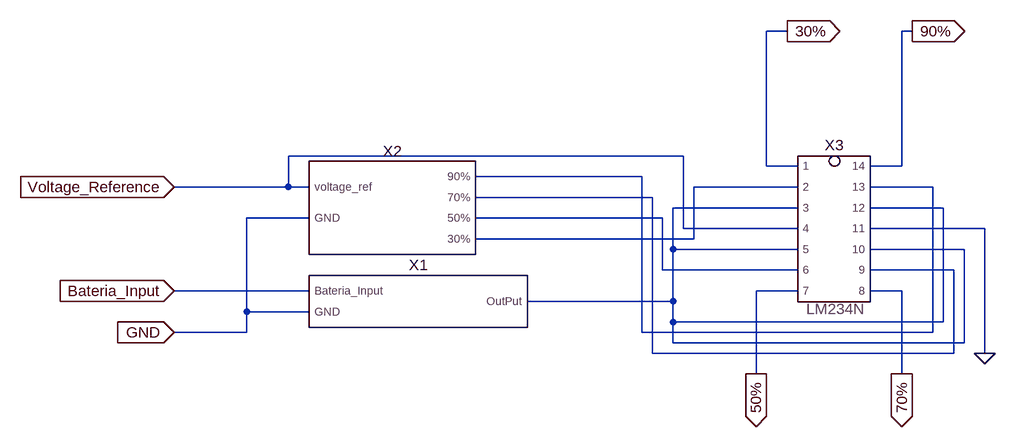
[diagram p0: schematic Modulo_bateria.asc]
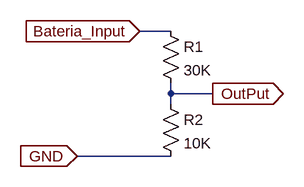
[diagram p1: sub-circuit dividor_bateria.asc]
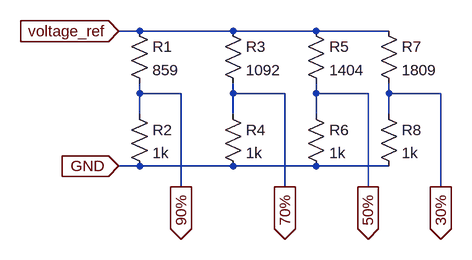
[diagram p2: sub-circuit referencia.asc]
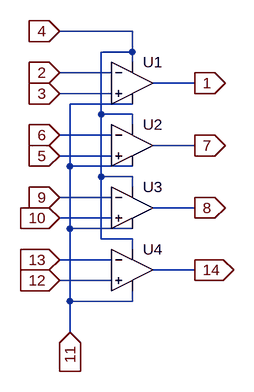
[diagram p3: sub-circuit comparador.asc]
Modulo_bateria.asc, the LTspice schematic file:
Version 4
SHEET 1 1048 680
WIRE 560 -176 528 -176
WIRE 752 -176 736 -176
WIRE 400 16 -208 16
WIRE 528 32 528 -176
WIRE 576 32 528 32
WIRE 736 32 736 -176
WIRE 736 32 688 32
WIRE 336 48 80 48
WIRE -208 64 -208 16
WIRE -208 64 -384 64
WIRE -176 64 -208 64
WIRE 576 64 416 64
WIRE 784 64 688 64
WIRE 352 80 80 80
WIRE 576 96 384 96
WIRE 800 96 688 96
WIRE -176 112 -272 112
WIRE 368 112 80 112
WIRE 400 128 400 16
WIRE 576 128 400 128
WIRE 864 128 688 128
WIRE 416 144 416 64
WIRE 416 144 80 144
WIRE 384 160 384 96
WIRE 576 160 384 160
WIRE 832 160 688 160
WIRE 368 192 368 112
WIRE 576 192 368 192
WIRE 816 192 688 192
WIRE -176 224 -384 224
WIRE 576 224 512 224
WIRE 736 224 688 224
WIRE 384 240 384 160
WIRE 384 240 160 240
WIRE -272 256 -272 112
WIRE -176 256 -272 256
WIRE 384 272 384 240
WIRE 800 272 800 96
WIRE 800 272 384 272
WIRE -272 288 -272 256
WIRE -272 288 -384 288
WIRE 336 288 336 48
WIRE 784 288 784 64
WIRE 784 288 336 288
WIRE 384 304 384 272
WIRE 832 304 832 160
WIRE 832 304 384 304
WIRE 352 320 352 80
WIRE 816 320 816 192
WIRE 816 320 352 320
WIRE 864 320 864 128
WIRE 512 352 512 224
WIRE 736 352 736 224
FLAG 864 320 0
FLAG 560 -176 30%
IOPIN 560 -176 Out
FLAG 512 352 50%
IOPIN 512 352 Out
FLAG 752 -176 90%
IOPIN 752 -176 Out
FLAG 736 352 70%
IOPIN 736 352 Out
FLAG -384 64 Voltage_Reference
IOPIN -384 64 In
FLAG -384 224 Bateria_Input
IOPIN -384 224 In
FLAG -384 288 GND
IOPIN -384 288 In
DATAFLAG 192 48 ""
DATAFLAG 192 80 ""
DATAFLAG 192 112 ""
DATAFLAG 192 144 ""
DATAFLAG 240 240 ""
DATAFLAG -272 64 ""
DATAFLAG -240 224 ""
DATAFLAG -288 288 ""
DATAFLAG 528 -64 ""
DATAFLAG 528 224 ""
DATAFLAG 720 224 ""
DATAFLAG 736 -80 ""
SYMBOL Dividor_Bateria -16 240 R0
SYMATTR InstName X1
SYMBOL Referencia -48 96 R0
SYMATTR InstName X2
SYMBOL Comparador 656 176 R0
SYMATTR InstName X3

dividor_bateria.asc, the sub-circuit schematic file:
Version 4
SHEET 1 880 680
WIRE 80 80 32 80
WIRE 80 176 80 160
WIRE 144 176 80 176
WIRE 80 192 80 176
WIRE 80 272 -64 272
FLAG 32 80 Bateria_Input
IOPIN 32 80 In
FLAG -64 272 GND
IOPIN -64 272 In
FLAG 144 176 OutPut
IOPIN 144 176 Out
SYMBOL res 64 64 R0
SYMATTR InstName R1
SYMATTR Value 30K
SYMBOL res 64 176 R0
SYMATTR InstName R2
SYMATTR Value 10K

referencia.asc, the sub-circuit schematic file:
Version 4
SHEET 1 880 680
WIRE 112 64 80 64
WIRE 256 64 112 64
WIRE 384 64 256 64
WIRE 496 64 384 64
WIRE 112 160 112 144
WIRE 176 160 112 160
WIRE 256 160 256 144
WIRE 336 160 256 160
WIRE 384 160 384 144
WIRE 464 160 384 160
WIRE 496 160 496 144
WIRE 576 160 496 160
WIRE 112 192 112 160
WIRE 256 192 256 160
WIRE 384 192 384 160
WIRE 496 192 496 160
WIRE 112 272 80 272
WIRE 256 272 112 272
WIRE 384 272 256 272
WIRE 496 272 384 272
WIRE 176 304 176 160
WIRE 336 304 336 160
WIRE 464 304 464 160
WIRE 576 304 576 160
FLAG 80 64 voltage_ref
IOPIN 80 64 In
FLAG 80 272 GND
IOPIN 80 272 In
FLAG 576 304 30%
IOPIN 576 304 Out
FLAG 464 304 50%
IOPIN 464 304 Out
FLAG 336 304 70%
IOPIN 336 304 Out
FLAG 176 304 90%
IOPIN 176 304 Out
SYMBOL res 96 48 R0
SYMATTR InstName R1
SYMATTR Value 859
SYMBOL res 96 176 R0
SYMATTR InstName R2
SYMATTR Value 1k
SYMBOL res 240 48 R0
SYMATTR InstName R3
SYMATTR Value 1092
SYMBOL res 240 176 R0
SYMATTR InstName R4
SYMATTR Value 1k
SYMBOL res 368 48 R0
SYMATTR InstName R5
SYMATTR Value 1404
SYMBOL res 368 176 R0
SYMATTR InstName R6
SYMATTR Value 1k
SYMBOL res 480 48 R0
SYMATTR InstName R7
SYMATTR Value 1809
SYMBOL res 480 176 R0
SYMATTR InstName R8
SYMATTR Value 1k

comparador.asc, the sub-circuit schematic file:
Version 4
SHEET 1 880 680
WIRE 96 0 -16 0
WIRE 96 32 96 0
WIRE 96 32 48 32
WIRE 96 48 96 32
WIRE 64 64 -16 64
WIRE 192 80 128 80
WIRE 64 96 -16 96
WIRE 96 112 0 112
WIRE 48 128 48 32
WIRE 96 128 48 128
WIRE 96 144 96 128
WIRE 64 160 -16 160
WIRE 192 176 128 176
WIRE 64 192 -16 192
WIRE 0 208 0 112
WIRE 96 208 0 208
WIRE 48 224 48 128
WIRE 96 224 48 224
WIRE 96 240 96 224
WIRE 64 256 -16 256
WIRE 192 272 128 272
WIRE 64 288 -16 288
WIRE 0 304 0 208
WIRE 96 304 0 304
WIRE 48 320 48 224
WIRE 96 320 48 320
WIRE 96 336 96 320
WIRE 64 352 -16 352
WIRE 192 368 128 368
WIRE 64 384 -16 384
WIRE 0 416 0 304
WIRE 96 416 96 400
WIRE 96 416 0 416
WIRE 0 464 0 416
FLAG 192 80 1
IOPIN 192 80 Out
FLAG 192 176 7
IOPIN 192 176 Out
FLAG 192 272 8
IOPIN 192 272 Out
FLAG 192 368 14
IOPIN 192 368 Out
FLAG -16 96 3
IOPIN -16 96 In
FLAG -16 64 2
IOPIN -16 64 In
FLAG -16 160 6
IOPIN -16 160 In
FLAG -16 192 5
IOPIN -16 192 In
FLAG -16 256 9
IOPIN -16 256 In
FLAG -16 288 10
IOPIN -16 288 In
FLAG -16 352 13
IOPIN -16 352 In
FLAG -16 384 12
IOPIN -16 384 In
FLAG -16 0 4
IOPIN -16 0 In
FLAG 0 464 11
IOPIN 0 464 In
SYMBOL Opamps\\UniversalOpamp2 96 80 R0
SYMATTR InstName U1
SYMBOL Opamps\\UniversalOpamp2 96 176 R0
SYMATTR InstName U2
SYMBOL Opamps\\UniversalOpamp2 96 272 R0
SYMATTR InstName U3
SYMBOL Opamps\\UniversalOpamp2 96 368 R0
SYMATTR InstName U4

The netlist it stands for:
* Modulo_bateria.asc
XX1 Bateria_Input GND N004 dividor_bateria
XX2 GND Voltage_Reference N002 N005 N003 N001 referencia
XX3 N004 N004 N001 N002 N004 Voltage_Reference N004 N005 N003 0 30% 90% 50% 70% comparador

* block symbol definitions
.subckt dividor_bateria Bateria_Input GND OutPut
R1 Bateria_Input OutPut 30K
R2 OutPut GND 10K
.ends dividor_bateria

.subckt referencia GND voltage_ref 30% 50% 70% 90%
R1 voltage_ref 90% 859
R2 90% GND 1k
R3 voltage_ref 70% 1092
R4 70% GND 1k
R5 voltage_ref 50% 1404
R6 50% GND 1k
R7 voltage_ref 30% 1809
R8 30% GND 1k
.ends referencia

.subckt comparador 10 12 13 2 3 4 5 6 9 11 1 14 7 8
XU1 3 2 4 11 1 level.2 Avol=1Meg GBW=10Meg Slew=10Meg ilimit=25m rail=0 Vos=0 phimargin=45 en=0 enk=0 in=0 ink=0 Rin=500Meg  ; pins IN+ IN- V+ V- OUT
XU2 5 6 4 11 7 level.2 Avol=1Meg GBW=10Meg Slew=10Meg ilimit=25m rail=0 Vos=0 phimargin=45 en=0 enk=0 in=0 ink=0 Rin=500Meg  ; pins IN+ IN- V+ V- OUT
XU3 10 9 4 11 8 level.2 Avol=1Meg GBW=10Meg Slew=10Meg ilimit=25m rail=0 Vos=0 phimargin=45 en=0 enk=0 in=0 ink=0 Rin=500Meg  ; pins IN+ IN- V+ V- OUT
XU4 12 13 4 11 14 level.2 Avol=1Meg GBW=10Meg Slew=10Meg ilimit=25m rail=0 Vos=0 phimargin=45 en=0 enk=0 in=0 ink=0 Rin=500Meg  ; pins IN+ IN- V+ V- OUT
.ends comparador

.lib UniversalOpamps2.sub
.backanno
.end